# EAGLE design working (EAGLE 9.3.2)
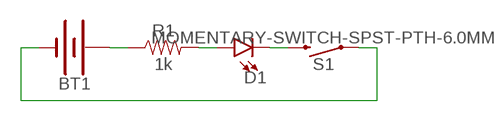
[diagram p0: schematic, sheet 1]

## Parts
BT1  BATTERY-20MM_SMD_4LEGS  [BATTCON_20MM_4LEGS]
D1  LED5MM  [LED_5MM]
R1  1k  1KOHM-HORIZ-1/4W-1%  [AXIAL-0.3]
S1  MOMENTARY-SWITCH-SPST-PTH-6.0MM  [TACTILE_SWITCH_PTH_6.0MM]

## Nets
N$1: BT1.POSITIVE@1(+) BT1.POSITIVE@2(+) BT1.POSITIVE@3(+) BT1.POSITIVE@4(+) R1.P$1
N$2: D1.A R1.P$2
N$3: D1.K(C) S1.3
N$4: BT1.NEGATIVE(-) S1.1

## Library data of the parts
BT1 = SparkFun-Batteries:BATTERY: Battery - Single Cell A variety of battery chemistries, sizes, and footprints. Device List: 20MM_PTH - Coin Cell Battery Holder - 20mm (PTH) <https://www.sparkfun.com/products/783> 20MM_PTH_KIT- Coin Cell battery Holder - 20 mm (PTH) <http://www.sparkfun.com/products/783>kit version with special mask 6.8MM_PTH - Coin Cell Battery Holder - 6.8MM(SMD) <https://www.digikey.com/product-detail/en/seiko-instruments/MS621FE-FL11E/728-1057-ND/1889208?WT.srch=1&gclid=CNOQ5a6LzdQCFZS2wAodXCkE0g> 12MM_SMD - Coin Cell Battery Holder - 12mm (SMD) <https://www.sparkfun.com/products/10592> 12MM_PTH - Coin Cell Battery Holder - 12mm (PTH) <https://www.sparkfun.com/products/7948> 20MM_SMD - 20mm Coin Cell Battery Holder (SMD) (2 legs) Used on the Big Time Watch Kit <https://www.sparkfun.com/products/11734> 20MM_SMD_4LEGS - Coin Cell Battery Holder - 20mm (SMD) <https://www.sparkfun.com/products/11892> 20MM_SMD_4LEGS_OVERPASTE - Coin Cell Battery Holder - 20mm (SMD) <https://www.sparkfun.com/products/11892> (Over-paste on the legs) 24.5MM_PTH - Coin Cell Battery Holder - 24.5mm (PTH) <https://www.sparkfun.com/products/8863> 9V - 9V Battery Holder - PC Mount Used on the SparkFun SparkPunk Sound Kit <https://www.sparkfun.com/products/11177> and SparkFun SparkPunk Sequencer Kit <https://www.sparkfun.com/products/12707> 18650 - Battery Holder - 18650 (PTH) <https://www.sparkfun.com/products/13113> AA - Battery Holder - 1xAA (PTH) <https://www.sparkfun.com/products/7949> AAA - Battery Holder - 1xAAA (PTH) <https://www.sparkfun.com/products/12718> AA_KIT - Battery Holder - 1xAA (PTH) <https://www.sparkfun.com/products/7949> Special kit package - pads only have exposed copper on one side of the board. AAA_KIT - Battery Holder - 1xAAA (PTH) <https://www.sparkfun.com/products/12718> Special kit package - pads only have exposed copper on one side of the board.; PROD_ID: BATT-10373; SF_SKU: PRT-11892
D1 = SparkFun-LED:LED: LED (Generic) Standard schematic elements and footprints for 5mm, 3mm, 1206, and 0603 sized LEDs. Generic LEDs with no color specified.
R1 = SparkFun-Resistors:1KOHM: 1kΩ resistor A resistor is a passive two-terminal electrical component that implements electrical resistance as a circuit element. Resistors act to reduce current flow, and, at the same time, act to lower voltage levels within circuits. - Wikipedia; PROD_ID: RES-12182
S1 = SparkFun-Switches:MOMENTARY-SWITCH-SPST: Momentary Switch (Pushbutton) - SPST Normally-open (NO) SPST momentary switches (buttons, pushbuttons). Variants PTH-12MM - 12mm square, through-hole Momentary Pushbutton Switch - 12mm Square <https://www.sparkfun.com/products/9190> (COM-09190) PTH-6.0MM, PTH-6.0MM-KIT - 6.0mm square, through-hole Mini Pushbutton Switch <https://www.sparkfun.com/products/97> (COM-00097) KIT package intended for soldering kit's - only one side of pads' copper is exposed. PTH-RIGHT-ANGLE-KIT - Right-angle, through-hole Right Angle Tactile Button <https://www.sparkfun.com/products/10791> - Used on SparkFun BigTime Watch Kit <https://www.sparkfun.com/products/11734> SMD-12MM - 12mm square, surface-mount Tactile Button - SMD (12mm) <https://www.sparkfun.com/products/12993> (COM-12993) Used on SparkFun PicoBoard <https://www.sparkfun.com/products/11888> SMD-4.5MM - 4.5mm Square Trackball Switch Used on SparkFun Blackberry Trackballer Breakout <https://www.sparkfun.com/products/13169> SMD-4.6MMX2.8MM - 4.60mm x 2.80mm, surface mount Used on SparkFun SAMD21 Mini Breakout <https://www.sparkfun.com/products/13664> SMD-5.2MM, SMD-5.2-REDUNDANT - 5.2mm square, surface-mount Mini Pushbutton Switch - SMD <https://www.sparkfun.com/products/8720> (COM-08720) Used on Arduino Pro Mini <https://www.sparkfun.com/products/11114> REDUNDANT package connects both switch circuits together SMD-6.0X3.5MM - 6.0 x 3.5mm, surface mount Momentary Reset Switch SMD <https://www.sparkfun.com/products/8229> (COM-08229) SMD-6.2MM-TALL - 6.2mm square, surface mount Tactile Button - SMD (6mm) <https://www.sparkfun.com/products/12992> Used on SparkFun Digital Sandbox <https://www.sparkfun.com/products/12651> SMD-RIGHT-ANGLE - Right-angle, surface mount Used on SparkFun Block for Intel® Edison - Arduino <https://www.sparkfun.com/products/13036>; PROD_ID: SWCH-08441; SF_SKU: COM-00097

## Board
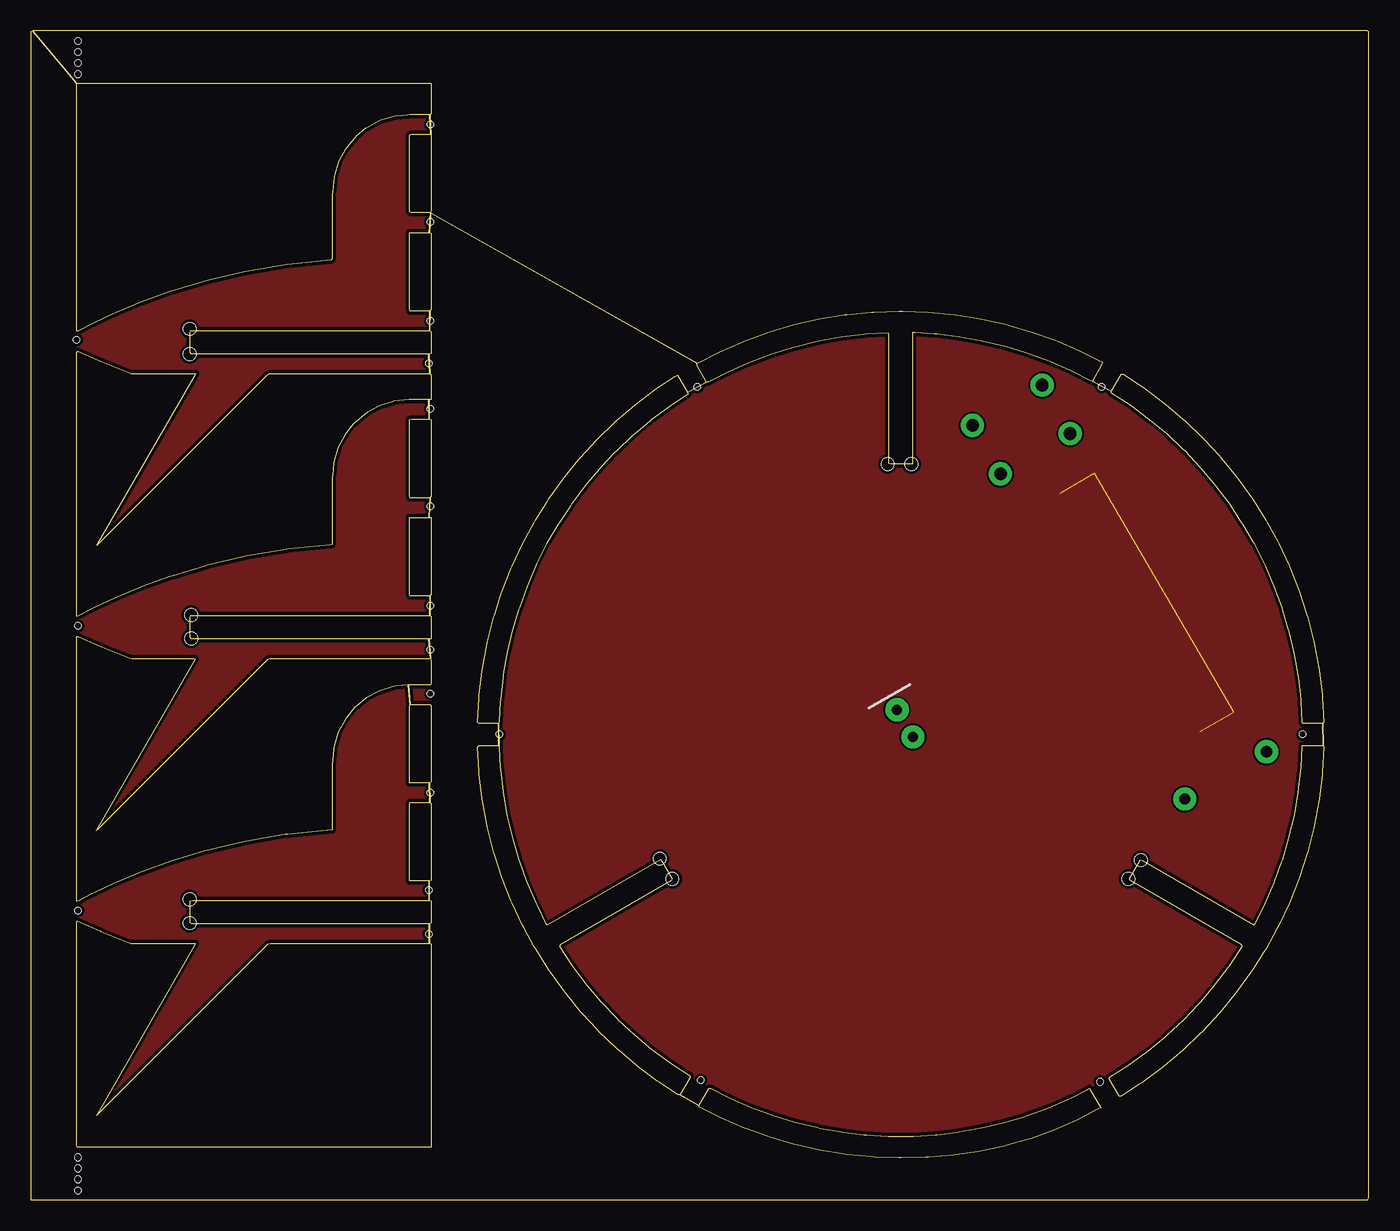
[diagram p1: board, top side]
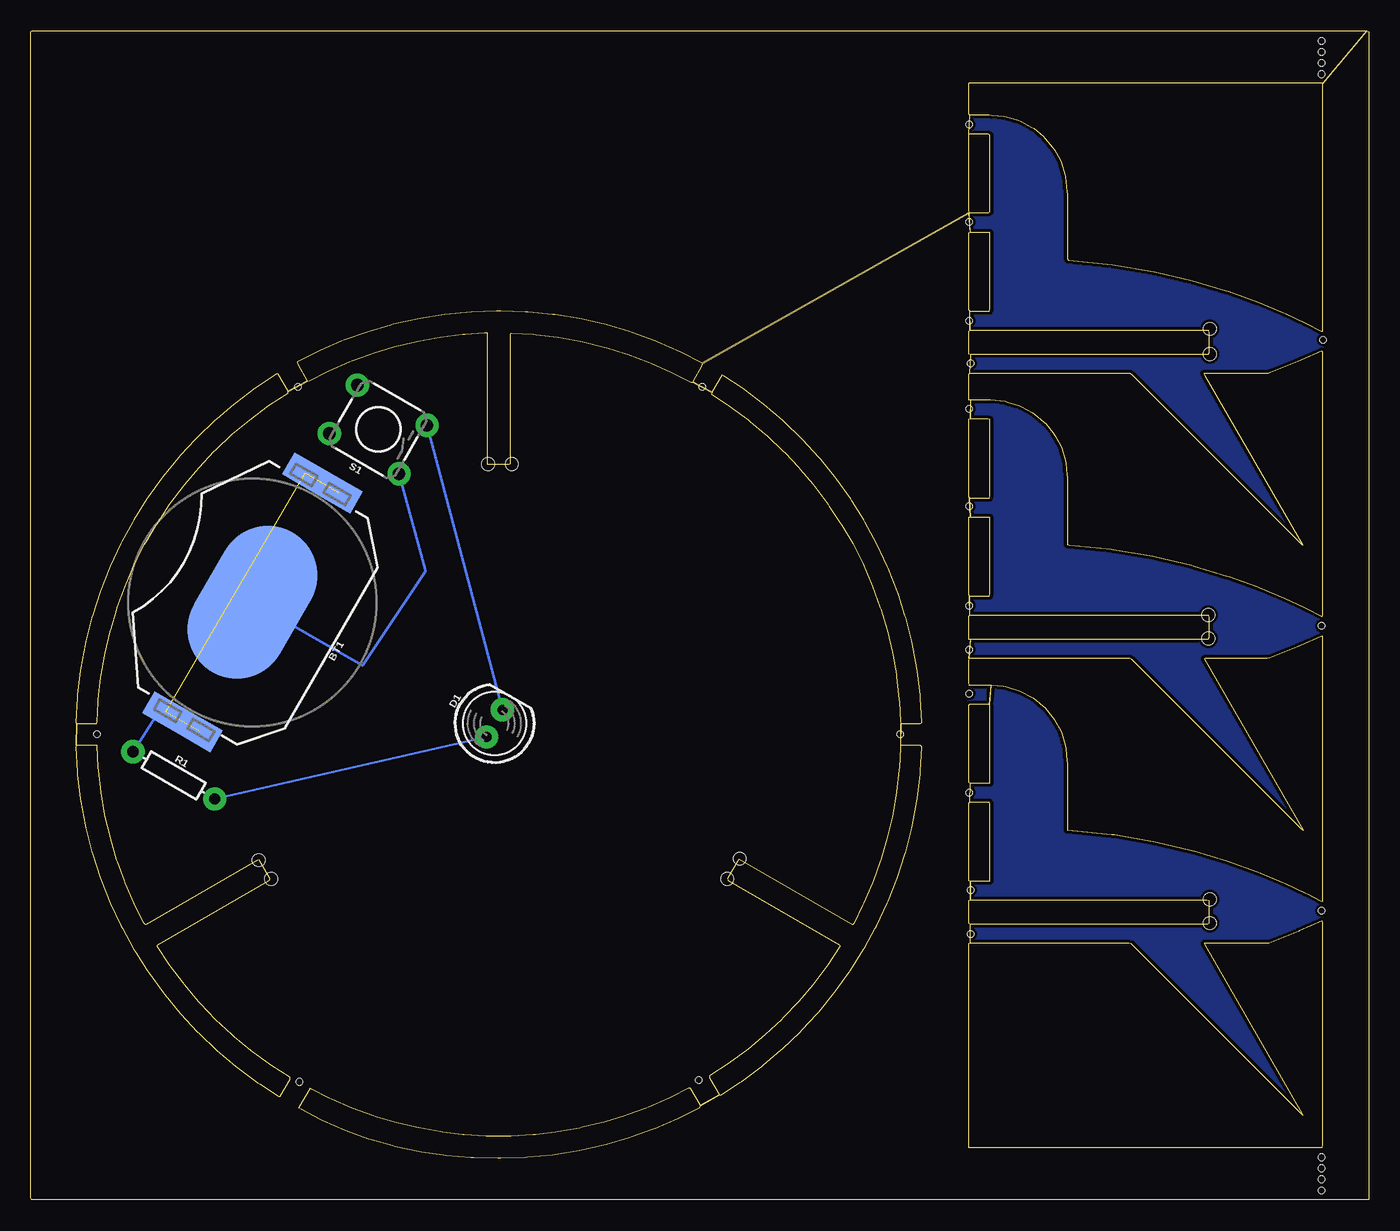
[diagram p2: board, bottom side, seen from below]

Size 108.06 x 94.43 mm. Coordinates in mm from the lower left corner, seen from the top.
Outline: 0,0 108,0 108.06,0.14 108.06,94.35 107.94,94.43 0.15,94.43 3.72,90.19 3.9,90.19 32.3,90.19 32.33,90.16 32.33,87.76 32.25,87.66 32.32,86.06 32.33,85.9 32.33,79.9 32.3,79.74 53.83,67.59 55.6,68.5 57.43,69.3 57.62,69.37 59.5,70.06 59.69,70.12 61.61,70.69 63.56,71.13 63.75,71.17 65.73,71.49 65.92,71.52 67.92,71.71 68.11,71.72 70.11,71.79 70.45,71.79 72.45,71.72 74.64,71.52 76.62,71.2 76.82,71.17 78.77,70.73 78.96,70.67 80.88,70.11 82.76,69.44 82.95,69.36 84.6,68.65 84.78,68.57 86.57,67.67 86.53,67.51 85.74,66.14 87.3,65.33 88.09,66.71 88.24,66.69 89.74,65.7 89.93,65.58 91.53,64.38 91.69,64.25 93.06,63.09 93.21,62.96 94.65,61.57 94.79,61.43 96.01,60.1 96.14,59.95 97.41,58.41 97.53,58.24 98.58,56.78 98.69,56.62 99.76,54.93 99.86,54.75 100.72,53.17 100.81,52.99 101.66,51.18 101.74,51 102.47,49.14 103.09,47.24 103.15,47.05 103.64,45.11 103.68,44.91 104.05,42.95 104.08,42.75 104.33,40.76 104.34,40.56 104.46,38.57 104.38,38.47 104.4,36.7 104.45,36.57 104.34,34.58 104.32,34.38 104.08,32.39 104.05,32.19 103.68,30.23 103.64,30.03 103.14,28.09 103.08,27.9 102.46,26 102.39,25.82 101.65,23.96 100.8,22.15 100.71,21.97 99.74,20.22 99.64,20.05 98.67,18.53 98.56,18.36 97.39,16.74 97.27,16.58 96,15.04 94.63,13.58 94.49,13.43 93.04,12.06 91.51,10.77 91.35,10.65 89.74,9.46 89.58,9.35 88.06,8.37 87.92,8.34 87.12,9.72 87.14,9.87 88.65,10.84 88.81,10.96 90.11,11.9 90.27,12.02 91.65,13.17 91.8,13.3 93.12,14.53 94.36,15.83 94.5,15.98 95.66,17.35 95.78,17.51 96.74,18.79 96.86,18.95 97.86,20.45 97.81,20.58 88.8,25.78 88.74,25.91 89.64,27.47 89.81,27.41 98.81,22.2 98.92,22.32 99.64,23.75 99.72,23.93 100.44,25.58 100.51,25.77 101.05,27.27 101.12,27.46 101.63,29.19 101.68,29.38 102.05,30.94 102.09,31.14 102.4,32.91 102.61,34.7 102.62,34.9 102.72,36.69 102.8,36.71 104.39,36.71 104.36,38.46 102.77,38.46 102.71,38.61 102.63,40.21 102.61,40.41 102.41,42.2 102.38,42.4 102.1,43.97 102.06,44.17 101.65,45.92 101.6,46.11 101.14,47.65 101.08,47.84 100.47,49.53 99.76,51.19 99.68,51.37 98.87,52.98 98.77,53.15 97.94,54.52 97.84,54.69 96.85,56.19 96.73,56.35 95.77,57.63 95.64,57.79 94.48,59.17 93.25,60.47 93.1,60.61 91.79,61.84 90.41,63 90.25,63.12 88.96,64.07 88.8,64.19 87.29,65.17 87.29,65.31 85.72,66.13 85.57,66.18 84.14,66.9 83.96,66.99 82.31,67.71 82.12,67.78 80.62,68.33 80.43,68.4 78.71,68.92 76.96,69.34 76.77,69.39 75,69.7 73.21,69.92 73.01,69.94 71.41,70.04 71.22,70.04 71.22,59.44 71.04,59.42 69.44,59.42 69.31,59.49 69.31,69.89 69.26,70.03 67.47,69.92 67.27,69.9 65.48,69.68 63.71,69.36 63.51,69.32 61.76,68.89 61.57,68.83 60.04,68.36 59.85,68.3 58.17,67.67 57.98,67.6 56.34,66.87 54.73,66.04 54.6,66.06 53.05,65.23 53.09,65.08 51.58,64.09 51.42,63.97 50.14,63.01 49.98,62.89 48.76,61.86 48.61,61.73 47.3,60.49 47.16,60.35 46.06,59.18 45.93,59.03 44.9,57.81 44.77,57.66 43.69,56.21 43.58,56.05 42.7,54.71 42.59,54.54 41.67,53 40.86,51.39 40.78,51.21 40.07,49.55 39.46,47.86 39.39,47.67 38.88,45.95 38.47,44.19 38.43,44 38.16,42.42 38.13,42.22 37.92,40.43 37.91,40.23 37.82,38.64 37.79,38.47 37.81,36.7 37.82,36.52 37.91,34.92 37.93,34.72 38.13,32.93 38.44,31.16 38.48,30.96 38.89,29.21 39.41,27.48 39.47,27.29 40.01,25.79 40.08,25.6 40.79,23.95 40.88,23.77 41.59,22.34 41.69,22.19 50.87,27.49 50.98,27.33 51.78,25.94 51.77,25.8 42.76,20.6 42.7,20.47 43.69,18.97 44.77,17.53 44.9,17.37 46.06,16 47.3,14.69 47.44,14.55 48.75,13.32 50.13,12.17 50.29,12.04 51.58,11.09 51.74,10.98 53.25,9.99 53.24,9.84 52.45,8.47 53.98,7.63 54.78,9.01 54.93,9.01 56.35,8.29 56.53,8.2 58.18,7.48 58.37,7.4 59.87,6.85 60.06,6.78 61.78,6.26 61.98,6.21 63.53,5.83 63.73,5.79 65.5,5.47 65.7,5.44 67.28,5.25 67.48,5.23 69.28,5.12 69.48,5.12 71.08,5.13 71.28,5.14 73.08,5.25 73.2,5.26 74.79,5.45 74.99,5.48 76.76,5.79 76.95,5.84 78.51,6.21 78.7,6.26 80.24,6.72 80.43,6.78 82.12,7.39 83.77,8.1 83.95,8.19 85.39,8.9 85.51,9.01 86.42,7.43 86.25,7.33 84.66,6.49 84.48,6.4 82.65,5.6 80.77,4.92 80.58,4.87 78.84,4.38 78.65,4.33 76.69,3.92 76.5,3.89 74.71,3.63 74.52,3.6 72.52,3.44 72.32,3.43 70.32,3.38 70.12,3.38 68.12,3.44 67.92,3.46 65.93,3.65 65.74,3.68 63.76,3.99 61.81,4.43 61.62,4.48 59.7,5.04 59.51,5.11 57.81,5.72 57.63,5.79 55.79,6.58 55.61,6.67 54.01,7.48 53.98,7.61 52.43,8.46 52.29,8.48 50.79,9.47 50.62,9.58 49.02,10.78 48.86,10.9 47.49,12.07 47.34,12.2 45.9,13.58 45.76,13.73 44.54,15.05 44.4,15.2 43.14,16.75 43.02,16.91 41.97,18.37 41.85,18.53 40.79,20.23 40.69,20.4 39.83,21.98 39.73,22.16 38.88,23.97 38.8,24.15 38.07,26.01 37.45,27.91 37.39,28.11 36.9,30.04 36.86,30.24 36.49,32.2 36.46,32.4 36.21,34.39 36.2,34.59 36.08,36.58 36.21,36.71 37.79,36.71 37.77,38.46 36.19,38.46 36.08,38.55 36.19,40.54 36.21,40.74 36.45,42.73 36.48,42.92 36.85,44.89 36.89,45.09 37.38,47.02 37.44,47.22 37.99,48.93 38.06,49.12 38.79,50.98 38.87,51.16 39.71,52.98 40.67,54.73 40.77,54.91 41.72,56.43 41.83,56.6 42.99,58.23 43.12,58.39 44.25,59.78 44.38,59.94 45.73,61.41 45.87,61.55 47.16,62.8 47.31,62.94 48.83,64.24 50.43,65.45 50.59,65.56 52.09,66.56 52.24,66.62 53.04,65.25 54.58,66.07 53.79,67.45 53.82,67.57 32.3,79.72 32.2,78.15 32.33,78.11 32.33,71.91 32.24,71.81 32.22,70.22 32.33,70.15 32.33,68.35 32.17,68.32 32.24,66.74 32.33,66.65 32.33,64.65 32.16,64.63 32.17,63.05 32.33,63.03 32.33,56.83 32.26,56.72 32.18,55.13 32.33,55.1 32.33,48.9 32.25,48.8 32.23,47.2 32.33,47.12 32.33,45.32 32.16,45.3 32.29,43.71 32.33,43.57 32.33,41.77 32.29,41.61 30.69,41.61 30.5,41.6 30.64,40.03 32.23,40.03 32.33,39.94 32.33,33.74 32.19,33.69 32.24,32.1 32.33,32.01 32.33,25.81 32.18,25.77 32.17,24.18 32.33,24.15 32.33,22.35 32.21,22.29 32.19,20.7 32.33,20.65 32.33,4.25 32.15,4.23 3.75,4.23 3.7,4.39 3.7,22.39 3.75,22.52 5.58,21.71 5.66,21.68 8.07,20.72 8.27,20.71 13.27,20.71 13.24,20.57 5.34,6.89 5.32,6.83 19.18,20.69 19.38,20.7 32.16,20.7 32.19,22.28 13,22.28 12.88,22.36 12.88,24.16 13.05,24.19 32.15,24.19 32.16,25.76 30.77,25.76 30.57,25.77 30.57,31.97 30.64,32.11 32.22,32.11 32.17,33.69 30.58,33.69 30.57,33.88 30.58,39.88 30.62,40.02 30.48,41.6 29.49,41.5 29.29,41.47 28.15,41.12 27.09,40.54 26.32,39.91 26.17,39.78 25.53,39.01 25.41,38.85 24.83,37.8 24.48,36.65 24.45,36.45 24.35,35.46 24.35,35.26 24.35,30.06 24.32,29.89 20.73,29.53 20.54,29.5 17.38,28.96 17.19,28.92 14.27,28.22 14.07,28.17 11.39,27.36 8.95,26.48 8.76,26.41 6.92,25.64 6.73,25.56 5.1,24.8 4.92,24.71 3.86,24.16 3.7,24.1 3.7,45.51 3.84,45.5 5.48,44.78 5.75,44.66 7.98,43.77 8.18,43.73 13.18,43.73 13.29,43.68 5.29,29.82 5.4,29.93 19.12,43.64 19.29,43.73 32.27,43.72 32.13,45.3 12.94,45.3 12.88,45.44 12.88,47.04 12.91,47.21 32.2,47.21 32.23,48.78 30.64,48.78 30.58,48.92 30.58,55.12 30.77,55.13 32.16,55.13 32.24,56.71 30.65,56.71 30.58,56.83 30.58,63.03 30.76,63.05 32.15,63.05 32.14,64.63 30.75,64.63 30.55,64.63 29.36,64.5 29.16,64.45 28.21,64.16 28.03,64.07 27.15,63.59 26.99,63.48 26.22,62.84 26.08,62.69 25.45,61.92 25.34,61.75 24.86,60.87 24.8,60.69 24.5,59.73 24.46,59.54 24.36,58.54 24.35,58.34 24.35,52.94 24.18,52.89 20.8,52.55 20.6,52.53 17.45,51.99 17.25,51.95 14.33,51.26 14.14,51.21 11.46,50.4 11.27,50.34 9.01,49.53 8.82,49.45 6.79,48.61 5.16,47.84 4.98,47.76 3.74,47.11 3.7,47.26 3.7,68.46 3.77,68.55 5.42,67.83 5.7,67.71 7.93,66.82 8.12,66.75 13.32,66.75 13.22,66.58 5.32,52.89 5.36,52.9 19.08,66.62 19.23,66.75 32.21,66.75 32.14,68.32 12.95,68.32 12.88,68.45 12.88,70.05 12.9,70.23 32.2,70.23 32.22,71.81 30.63,71.81 30.58,71.96 30.58,77.96 30.59,78.15 32.17,78.15 32.27,79.73 30.7,79.73 30.58,79.81 30.58,86.01 30.72,86.07 32.3,86.07 32.23,87.65 30.64,87.65 30.44,87.64 29.44,87.53 29.25,87.5 28.29,87.2 28.11,87.13 27.23,86.66 27.06,86.55 26.29,85.92 26.14,85.78 25.5,85.01 25.39,84.85 24.91,83.97 24.82,83.79 24.53,82.83 24.47,82.64 24.35,81.45 24.35,81.25 24.35,76.05 24.27,75.92 20.69,75.56 17.33,74.99 17.14,74.95 14.22,74.25 13.84,74.14 11.54,73.45 11.35,73.39 8.9,72.51 6.87,71.66 6.69,71.58 5.06,70.82 3.81,70.17 3.7,70.19 3.7,90.18 0.13,94.42 0,94.37 0,0.16 0,0
Copper layers (1*16): Top 0.035mm / dielectric 1.5mm / Bottom 0.035mm
Design rules "default *": minimum track width 6mil, minimum drill 0.35mm, track to track 6mil, track to pad 6mil, pad to pad 6mil, via to via 6mil, smd to smd 6mil, copper to edge 10mil, drill to drill 6mil, minimum pad ring 10mil, minimum via ring 8mil, stop-mask expansion 4mil, vias tented up to drill 0mil, thermal gap 10mil
Holes 0.51 mm at 32.26,86.87 32.26,78.99 32.26,70.99 32.13,67.56 32.26,63.88 32.26,56.01 32.26,48.01 32.26,44.45 32.26,40.89 32.26,32.89 32.13,25.02 32.13,21.46 3.81,23.37 3.81,46.35 3.68,69.47 53.85,65.66 86.49,65.66 102.74,37.59 86.36,9.53 54.1,9.65 37.85,37.59 3.81,93.6 3.81,92.71 3.81,91.82 3.81,90.93 3.81,3.43 3.81,2.54 3.81,1.65 3.81,0.76
Holes 1.02 mm at 12.83,70.36 12.83,68.33 12.95,47.24 12.95,45.34 12.83,24.26 12.83,22.35 69.22,59.44 71.12,59.44 88.65,25.91 89.66,27.43 50.8,27.56 51.82,25.91

### Footprints (pad centres in the part's own frame; a part is rotated, then mirrored left to right if it is on the bottom)
BATTCON_20MM_4LEGS = smd 13 x 8: NEGATIVE 0,0 | smd 2.032 x 3.175: POSITIVE@1 -11.176,1.651; POSITIVE@2 -11.176,-1.524; POSITIVE@3 11.176,1.524; POSITIVE@4 11.176,-1.651
LED_5MM = drill 0.813 pad 1.88: A -1.27,0; K 1.27,0
AXIAL-0.3 = drill 0.9 pad 1.88: P$1 -3.81,0; P$2 3.81,0
TACTILE_SWITCH_PTH_6.0MM = drill 1.016 pad 1.88: 1 -3.251,2.261; 2 3.251,2.261; 3 -3.251,-2.261; 4 3.251,-2.261

### Placement (x,y rotation side)
BT1  90.17,48.26 240 bottom
D1  70.61,38.48 60 bottom
R1  96.52,34.29 330 bottom
S1  80.01,62.23 150 bottom

### Tracks (layer width: path | path; a pad name or v marks a point on that pad's centre or on a via)
GND
  pour Top (rank 3): 3.7,70.12 3.7,68.72 3.77,68.56 8.01,66.79 8.2,66.75 13.2,66.75 13.28,66.67 5.28,52.82 19.13,66.68 19.31,66.75 32.3,66.75 32.33,66.92 32.33,68.32 32.13,68.32 12.94,68.32 12.88,68.47 12.88,70.07 12.92,70.23 32.32,70.23 32.33,70.42 32.33,71.62 32.32,71.81 30.72,71.81 30.58,71.87 30.58,78.07 30.7,78.15 32.3,78.15 32.33,78.32 32.33,79.72 32.14,79.73 30.74,79.73 30.58,79.77 30.58,85.97 30.68,86.07 32.28,86.07 32.33,86.22 32.33,87.62 32.16,87.65 30.76,87.65 30.56,87.65 28.21,87.17 28.04,87.08 26.21,85.85 26.09,85.7 24.86,83.87 24.81,83.68 24.37,81.53 24.35,81.33 24.35,76.13 24.35,75.93 17.41,75 17.22,74.96 11.42,73.41 11.23,73.34 6.94,71.69 6.76,71.61
  pour Top (rank 3): 3.7,47.09 3.7,45.69 3.76,45.54 8.01,43.77 8.2,43.73 13.2,43.73 13.27,43.65 5.27,29.8 19.13,43.66 19.3,43.73 32.3,43.72 32.33,43.9 32.33,45.3 32.13,45.3 12.93,45.3 12.88,45.45 12.88,47.05 12.92,47.21 32.32,47.21 32.33,47.4 32.33,48.6 32.32,48.79 30.72,48.79 30.58,48.85 30.58,55.05 30.69,55.13 32.29,55.13 32.33,55.3 32.33,56.7 32.14,56.71 30.74,56.71 30.58,56.75 30.58,62.94 30.67,63.05 32.27,63.05 32.33,63.2 32.33,64.6 32.16,64.63 30.76,64.63 30.56,64.63 28.21,64.15 28.03,64.06 26.21,62.83 26.09,62.68 24.86,60.85 24.81,60.66 24.37,58.5 24.35,58.31 24.35,53.11 24.35,52.91 17.41,51.98 17.21,51.94 11.42,50.39 11.23,50.32 6.94,48.67 6.75,48.59
  pour Top (rank 3): 3.7,24.07 3.7,22.67 3.76,22.52 8.01,20.75 8.2,20.71 13.2,20.71 13.27,20.63 5.27,6.78 19.13,20.64 19.3,20.71 32.3,20.7 32.33,20.88 32.33,22.28 32.13,22.28 12.93,22.28 12.88,22.43 12.88,24.03 12.92,24.19 32.31,24.19 32.32,24.38 32.32,25.58 32.31,25.76 30.71,25.76 30.57,25.83 30.58,32.02 30.69,32.11 32.29,32.11 32.33,32.27 32.33,33.67 32.14,33.69 30.74,33.69 30.58,33.72 30.58,39.92 30.67,40.03 32.27,40.03 32.33,40.17 32.33,41.57 32.16,41.61 30.76,41.61 30.56,41.6 28.21,41.13 28.03,41.04 26.21,39.81 26.08,39.65 24.85,37.83 24.8,37.64 24.37,35.48 24.35,35.29 24.35,30.09 24.34,29.89 17.41,28.96 17.21,28.92 11.42,27.37 11.23,27.3 6.94,25.65 6.75,25.57
  pour Top (rank 3): 71.22,70.05 71.22,59.45 71.05,59.42 69.45,59.42 69.31,59.48 69.31,69.88 69.27,70.03 65.48,69.68 61.76,68.89 61.57,68.83 58.17,67.67 57.98,67.59 54.73,66.04 54.58,66.01 51.04,63.74 50.88,63.63 47.68,60.91 47.53,60.77 44.86,57.79 44.73,57.64 42.35,54.18 42.25,54 40.45,50.43 40.36,50.25 38.98,46.29 38.93,46.09 38.12,42.17 38.08,41.98 37.79,37.79 37.78,37.59 37.92,34.79 37.94,34.59 38,34 38.39,31.42 38.47,31.03 38.51,30.84 39.21,28.12 39.26,27.93 39.33,27.74 40.29,25.11 40.36,24.93 41.67,22.22 41.82,22.26 50.83,27.46 50.95,27.37 51.75,25.99 51.81,25.83 42.8,20.62 42.7,20.51 43.12,19.82 43.23,19.66 43.91,18.67 44.88,17.4 45,17.24 45.91,16.17 46.04,16.02 46.86,15.14 47,15 48.44,13.61 48.58,13.48 49.03,13.08 49.19,12.95 51.56,11.11 51.72,10.99 53.22,10.01 53.38,9.9 57.1,7.95 57.28,7.86 61.42,6.37 61.61,6.33 65.72,5.46 65.92,5.43 70.11,5.14 70.31,5.13 74.9,5.47 75.1,5.5 79.59,6.51 79.78,6.57 84.07,8.22 84.25,8.31 88.25,10.58 88.42,10.69 88.91,11.03 90.98,12.6 91.14,12.73 91.29,12.86 91.44,12.99 93.34,14.76 93.49,14.9 93.63,15.05 93.76,15.19 95.61,17.3 95.74,17.45 97.79,20.41 97.85,20.56 88.84,25.76 88.72,25.88 89.62,27.44 89.77,27.43 98.78,22.23 98.9,22.32 99.1,22.66 99.19,22.84 99.28,23.02 100.43,25.57 100.5,25.76 100.58,25.95 100.64,26.13 101.46,28.6 101.52,28.79 101.63,29.18 102.2,31.72 102.23,31.91 102.3,32.31 102.33,32.5 102.62,34.89 102.64,35.09 102.7,36.08 102.71,36.28 102.75,37.48 102.75,37.68 102.46,41.87 102.44,42.07 101.59,46.19 101.54,46.38 100.15,50.34 100.06,50.52 98.25,54.09 98.15,54.26 95.77,57.72 95.64,57.88 92.96,60.84 92.82,60.99 89.61,63.7 89.45,63.82 85.9,66.07 85.74,66.14 85.58,66.17 82.69,67.54 82.51,67.63 79.3,68.75 79.11,68.8 75.99,69.53 75.8,69.57 72.42,69.98 72.22,70
  pour Bottom (rank 3): 3.7,70.12 3.7,68.72 3.77,68.56 8.01,66.79 8.2,66.75 13.2,66.75 13.28,66.67 5.28,52.82 19.13,66.68 19.31,66.75 32.3,66.75 32.33,66.92 32.33,68.32 32.13,68.32 12.94,68.32 12.88,68.47 12.88,70.07 12.92,70.23 32.32,70.23 32.33,70.42 32.33,71.62 32.32,71.81 30.72,71.81 30.58,71.87 30.58,78.07 30.7,78.15 32.3,78.15 32.33,78.32 32.33,79.72 32.14,79.73 30.74,79.73 30.58,79.77 30.58,85.97 30.68,86.07 32.28,86.07 32.33,86.22 32.33,87.62 32.16,87.65 30.76,87.65 30.56,87.65 28.21,87.17 28.04,87.08 26.21,85.85 26.09,85.7 24.86,83.87 24.81,83.68 24.37,81.53 24.35,81.33 24.35,76.13 24.35,75.93 17.41,75 17.22,74.96 11.42,73.41 11.23,73.34 6.94,71.69 6.76,71.61
  pour Bottom (rank 3): 3.7,47.09 3.7,45.69 3.76,45.54 8.01,43.77 8.2,43.73 13.2,43.73 13.27,43.65 5.27,29.8 19.13,43.66 19.3,43.73 32.3,43.72 32.33,43.9 32.33,45.3 32.13,45.3 12.93,45.3 12.88,45.45 12.88,47.05 12.92,47.21 32.32,47.21 32.33,47.4 32.33,48.6 32.32,48.79 30.72,48.79 30.58,48.85 30.58,55.05 30.69,55.13 32.29,55.13 32.33,55.3 32.33,56.7 32.14,56.71 30.74,56.71 30.58,56.75 30.58,62.94 30.67,63.05 32.27,63.05 32.33,63.2 32.33,64.6 32.16,64.63 30.76,64.63 30.56,64.63 28.21,64.15 28.03,64.06 26.21,62.83 26.09,62.68 24.86,60.85 24.81,60.66 24.37,58.5 24.35,58.31 24.35,53.11 24.35,52.91 17.41,51.98 17.21,51.94 11.42,50.39 11.23,50.32 6.94,48.67 6.75,48.59
  pour Bottom (rank 3): 3.7,24.07 3.7,22.67 3.76,22.52 8.01,20.75 8.2,20.71 13.2,20.71 13.27,20.63 5.27,6.78 19.13,20.64 19.3,20.71 32.3,20.7 32.33,20.88 32.33,22.28 32.13,22.28 12.93,22.28 12.88,22.43 12.88,24.03 12.92,24.19 32.31,24.19 32.32,24.38 32.32,25.58 32.31,25.76 30.71,25.76 30.57,25.83 30.58,32.02 30.69,32.11 32.29,32.11 32.33,32.27 32.33,33.67 32.14,33.69 30.74,33.69 30.58,33.72 30.58,39.92 30.67,40.03 32.27,40.03 32.33,40.17 32.33,41.57 32.16,41.61 30.76,41.61 30.56,41.6 28.21,41.13 28.03,41.04 26.21,39.81 26.08,39.65 24.85,37.83 24.8,37.64 24.37,35.48 24.35,35.29 24.35,30.09 24.34,29.89 17.41,28.96 17.21,28.92 11.42,27.37 11.23,27.3 6.94,25.65 6.75,25.57
  pour Top (rank 3): 3.7,70.12 3.7,68.72 3.77,68.56 8.01,66.79 8.2,66.75 13.2,66.75 13.28,66.67 5.28,52.82 19.13,66.68 19.31,66.75 32.3,66.75 32.33,66.92 32.33,68.32 32.13,68.32 12.94,68.32 12.88,68.47 12.88,70.07 12.92,70.23 32.32,70.23 32.33,70.42 32.33,71.62 32.32,71.81 30.72,71.81 30.58,71.87 30.58,78.07 30.7,78.15 32.3,78.15 32.33,78.32 32.33,79.72 32.14,79.73 30.74,79.73 30.58,79.77 30.58,85.97 30.68,86.07 32.28,86.07 32.33,86.22 32.33,87.62 32.16,87.65 30.76,87.65 30.56,87.65 28.21,87.17 28.04,87.08 26.21,85.85 26.09,85.7 24.86,83.87 24.81,83.68 24.37,81.53 24.35,81.33 24.35,76.13 24.35,75.93 17.41,75 17.22,74.96 11.42,73.41 11.23,73.34 6.94,71.69 6.76,71.61
  pour Top (rank 3): 3.7,47.09 3.7,45.69 3.76,45.54 8.01,43.77 8.2,43.73 13.2,43.73 13.27,43.65 5.27,29.8 19.13,43.66 19.3,43.73 32.3,43.72 32.33,43.9 32.33,45.3 32.13,45.3 12.93,45.3 12.88,45.45 12.88,47.05 12.92,47.21 32.32,47.21 32.33,47.4 32.33,48.6 32.32,48.79 30.72,48.79 30.58,48.85 30.58,55.05 30.69,55.13 32.29,55.13 32.33,55.3 32.33,56.7 32.14,56.71 30.74,56.71 30.58,56.75 30.58,62.94 30.67,63.05 32.27,63.05 32.33,63.2 32.33,64.6 32.16,64.63 30.76,64.63 30.56,64.63 28.21,64.15 28.03,64.06 26.21,62.83 26.09,62.68 24.86,60.85 24.81,60.66 24.37,58.5 24.35,58.31 24.35,53.11 24.35,52.91 17.41,51.98 17.21,51.94 11.42,50.39 11.23,50.32 6.94,48.67 6.75,48.59
  pour Top (rank 3): 3.7,24.07 3.7,22.67 3.76,22.52 8.01,20.75 8.2,20.71 13.2,20.71 13.27,20.63 5.27,6.78 19.13,20.64 19.3,20.71 32.3,20.7 32.33,20.88 32.33,22.28 32.13,22.28 12.93,22.28 12.88,22.43 12.88,24.03 12.92,24.19 32.31,24.19 32.32,24.38 32.32,25.58 32.31,25.76 30.71,25.76 30.57,25.83 30.58,32.02 30.69,32.11 32.29,32.11 32.33,32.27 32.33,33.67 32.14,33.69 30.74,33.69 30.58,33.72 30.58,39.92 30.67,40.03 32.27,40.03 32.33,40.17 32.33,41.57 32.16,41.61 30.76,41.61 30.56,41.6 28.21,41.13 28.03,41.04 26.21,39.81 26.08,39.65 24.85,37.83 24.8,37.64 24.37,35.48 24.35,35.29 24.35,30.09 24.34,29.89 17.41,28.96 17.21,28.92 11.42,27.37 11.23,27.3 6.94,25.65 6.75,25.57
N$1  (3 unrouted)
  Bottom 0.203: R1.P$1 97.79,39.37 BT1.POSITIVE@4
N$2
  Bottom 0.203: D1.A R1.P$2
N$3
  Bottom 0.203: S1.3 D1.K
N$4
  Bottom 0.203: S1.1 76.2,50.8 81.28,43.18 BT1.NEGATIVE